# Altium project RelayTester.PrjPcb
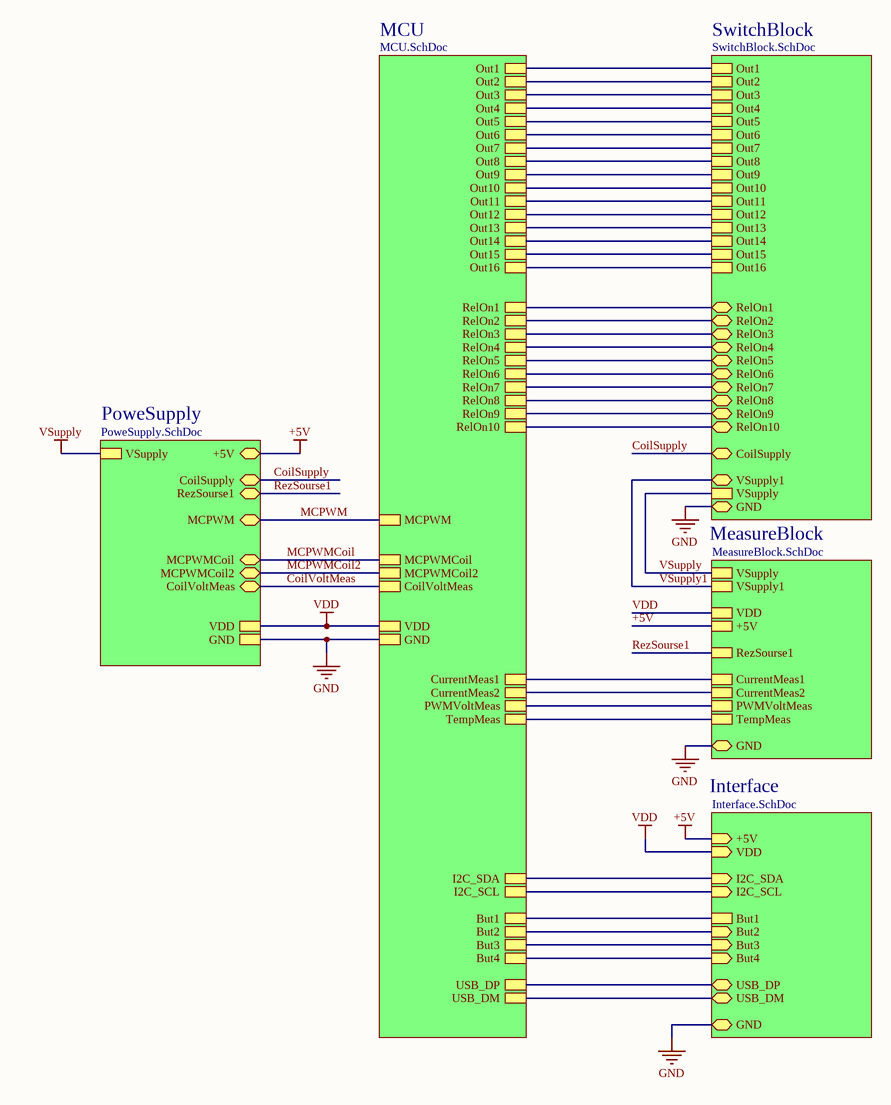
[diagram p0: RelayTester.SchDoc]
Adress2: Ivan Perehiniak
6 sheets, 234 parts. Net scope: hierarchical (ports join the sheet entries above them; power ports are global).
Board file: RelayTester.PcbDoc
Sheets:
  RelayTester.SchDoc
    Interface = Interface.SchDoc
    PoweSupply = PoweSupply.SchDoc
    MeasureBlock = MeasureBlock.SchDoc
    MCU = MCU.SchDoc
    SwitchBlock = SwitchBlock.SchDoc

## Sheet RelayTester.SchDoc: Relay Tester
size A4 portrait; Date: 2018.12.12; DrawnBy: Ivan Perehiniak; Address2: Ivan Perehiniak; Address3: iv.perehinik@gmail.com; Revision: 3; SheetNumber: 1; SheetTotal: 6; ProjectName: Relay Tester

### Sub-sheets
Interface = Interface.SchDoc: +5V, I2C_SDA, I2C_SCL, GND, But1, But2, But3, But4, VDD, USB_DM, USB_DP
MCU = MCU.SchDoc: But1, But2, But3, But4, I2C_SCL, I2C_SDA, Out9, Out8, RelOn5, RelOn6, RelOn3, RelOn4, RelOn1, RelOn2, CoilVoltMeas, PWMVoltMeas, CurrentMeas1, CurrentMeas2, TempMeas, MCPWMCoil, MCPWM, RelOn9, RelOn10, MCPWMCoil2, USB_DM, USB_DP, Out13, Out15, Out14, Out16, RelOn7, RelOn8, Out1, Out3, Out2, Out4, Out6, Out5, Out7, Out10, Out12, Out11, VDD, GND
MeasureBlock = MeasureBlock.SchDoc: VSupply1, VSupply, VDD, CurrentMeas1, RezSourse1, PWMVoltMeas, CurrentMeas2, TempMeas, +5V, GND
PoweSupply = PoweSupply.SchDoc: VSupply, VDD, GND, +5V, CoilSupply, CoilVoltMeas, MCPWMCoil, MCPWMCoil2, MCPWM, RezSourse1
SwitchBlock = SwitchBlock.SchDoc: Out1, Out2, Out3, Out4, Out5, Out6, Out7, Out8, Out9, Out10, Out11, Out12, Out13, Out14, Out15, Out16, VSupply, GND, VSupply1, RelOn10, CoilSupply, RelOn9, RelOn8, RelOn4, RelOn7, RelOn2, RelOn3, RelOn1, RelOn5, RelOn6

### Nets
+5V: sheet Interface/+5V, sheet PoweSupply/+5V, sheet MeasureBlock/+5V
CoilSupply: sheet PoweSupply/CoilSupply, sheet SwitchBlock/CoilSupply
GND: sheet Interface/GND, sheet PoweSupply/GND, sheet MeasureBlock/GND, sheet MCU/GND, sheet SwitchBlock/GND
VDD: sheet Interface/VDD, sheet PoweSupply/VDD, sheet MeasureBlock/VDD, sheet MCU/VDD
VSupply: sheet PoweSupply/VSupply, sheet MeasureBlock/VSupply, sheet SwitchBlock/VSupply
But1: sheet Interface/But1, sheet MCU/But1
But2: sheet Interface/But2, sheet MCU/But2
But3: sheet Interface/But3, sheet MCU/But3
But4: sheet Interface/But4, sheet MCU/But4
CoilVoltMeas: sheet PoweSupply/CoilVoltMeas, sheet MCU/CoilVoltMeas
CurrentMeas1: sheet MeasureBlock/CurrentMeas1, sheet MCU/CurrentMeas1
CurrentMeas2: sheet MeasureBlock/CurrentMeas2, sheet MCU/CurrentMeas2
DM: sheet Interface/USB_DM, sheet MCU/USB_DM
DP: sheet Interface/USB_DP, sheet MCU/USB_DP
I2C_SCL: sheet Interface/I2C_SCL, sheet MCU/I2C_SCL
I2C_SDA: sheet Interface/I2C_SDA, sheet MCU/I2C_SDA
MCPWM: sheet PoweSupply/MCPWM, sheet MCU/MCPWM
MCPWMCoil: sheet PoweSupply/MCPWMCoil, sheet MCU/MCPWMCoil
MCPWMCoil2: sheet PoweSupply/MCPWMCoil2, sheet MCU/MCPWMCoil2
Out1: sheet MCU/Out1, sheet SwitchBlock/Out1
Out2: sheet MCU/Out2, sheet SwitchBlock/Out2
Out3: sheet MCU/Out3, sheet SwitchBlock/Out3
Out4: sheet MCU/Out4, sheet SwitchBlock/Out4
Out5: sheet MCU/Out5, sheet SwitchBlock/Out5
Out6: sheet MCU/Out6, sheet SwitchBlock/Out6
Out7: sheet MCU/Out7, sheet SwitchBlock/Out7
Out8: sheet MCU/Out8, sheet SwitchBlock/Out8
Out9: sheet MCU/Out9, sheet SwitchBlock/Out9
Out10: sheet MCU/Out10, sheet SwitchBlock/Out10
Out11: sheet MCU/Out11, sheet SwitchBlock/Out11
Out12: sheet MCU/Out12, sheet SwitchBlock/Out12
Out13: sheet MCU/Out13, sheet SwitchBlock/Out13
Out14: sheet MCU/Out14, sheet SwitchBlock/Out14
Out15: sheet MCU/Out15, sheet SwitchBlock/Out15
Out16: sheet MCU/Out16, sheet SwitchBlock/Out16
PWMVoltMeas: sheet MeasureBlock/PWMVoltMeas, sheet MCU/PWMVoltMeas
RelOn1: sheet MCU/RelOn1, sheet SwitchBlock/RelOn1
RelOn2: sheet MCU/RelOn2, sheet SwitchBlock/RelOn2
RelOn3: sheet MCU/RelOn3, sheet SwitchBlock/RelOn3
RelOn4: sheet MCU/RelOn4, sheet SwitchBlock/RelOn4
RelOn5: sheet MCU/RelOn5, sheet SwitchBlock/RelOn5
RelOn6: sheet MCU/RelOn6, sheet SwitchBlock/RelOn6
RelOn7: sheet MCU/RelOn7, sheet SwitchBlock/RelOn7
RelOn8: sheet MCU/RelOn8, sheet SwitchBlock/RelOn8
RelOn9: sheet MCU/RelOn9, sheet SwitchBlock/RelOn9
RelOn10: sheet MCU/RelOn10, sheet SwitchBlock/RelOn10
RezSourse1: sheet PoweSupply/RezSourse1, sheet MeasureBlock/RezSourse1
TempMeas: sheet MeasureBlock/TempMeas, sheet MCU/TempMeas
VSupply1: sheet MeasureBlock/VSupply1, sheet SwitchBlock/VSupply1

### Notes on the sheet
- Title
- Size:
- Date:
- A4
- Number:
- Time:
- Revision:
- Sheet
- of
- File:

## Sheet Interface.SchDoc: Relay Tester
size A4 portrait; Date: 2018.12.12; Author: Ivan Perehiniak; Address2: Ivan Perehiniak; Address3: iv.perehinik@gmail.com; Revision: 3; SheetNumber: 3; SheetTotal: 6
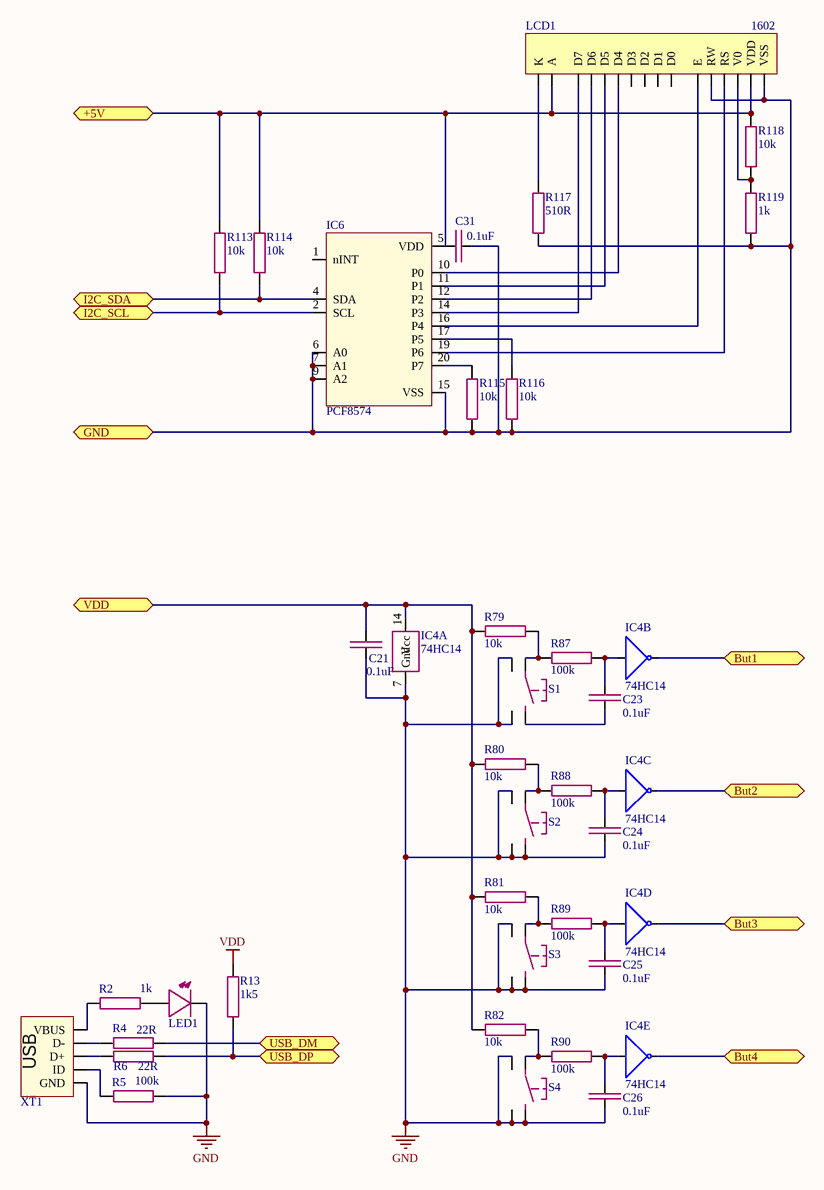
[diagram p1: Interface.SchDoc]

### Parts
C21  0.1uF  [C0603]
C23  0.1uF  [C0603]
C24  0.1uF  [C0603]
C25  0.1uF  [C0603]
C26  0.1uF  [C0603]
C31  0.1uF  [C0603]
IC4  74HC14  [SSOP14]  (parts A,B,C,D,E of 7)
IC6  PCF8574  [SSOP-20N]
LCD1  1602  [Display1602]
LED1  Green LED  [LED0805]  (value not drawn)
R2  1k  [R0603]
R4  22R  [R0603]
R5  100k  [R0603]
R6  22R  [R0603]
R13  1k5  [R0603]
R79  10k  [R0603]
R80  10k  [R0603]
R81  10k  [R0603]
R82  10k  [R0603]
R87  100k  [R0603]
R88  100k  [R0603]
R89  100k  [R0603]
R90  100k  [R0603]
R113  10k  [R0603]
R114  10k  [R0603]
R115  10k  [R0603]
R116  10k  [R0603]
R117  510R  [R0603]
R118  10k  [R0603]
R119  1k  [R0603]
S1  1301.9503  [SW_TACT_HOR]  (value not drawn)
S2  1301.9503  [SW_TACT_HOR]  (value not drawn)
S3  1301.9503  [SW_TACT_HOR]  (value not drawn)
S4  1301.9503  [SW_TACT_HOR]  (value not drawn)
XT1  UX60-MB-5ST  [MiniUSB]  (value not drawn)

### Ports
+5V, But1, But2, But3, But4, GND, I2C_SCL, I2C_SDA, USB_DM, USB_DP, VDD

### Nets
+5V: C31.2 IC6.5(VDD) LCD1.2(VDD) LCD1.15(A) R113.2 R114.2 R118.2 ; port +5V
GND: C21.1 C24.1 C25.1 C26.1 C31.1 IC4.7(Gnd) IC6.6(A0) IC6.7(A1) IC6.9(A2) IC6.15(VSS) LCD1.1(VSS) LCD1.5(RW) LED1.2(Cathode) R5.2 R115.1 R116.1 R117.2 R119.1 S1.1 S1.3 S2.1 S2.3 S2.4 S3.1 S3.3 S3.4 S4.1 S4.3 S4.4 XT1.5(GND) ; port GND
VDD: C21.2 IC4.14(Vcc) R13.2 R79.2 R80.2 R81.2 R82.2 ; port VDD
But1: IC4.2 ; port But1
But2: IC4.4 ; port But2
But3: IC4.6 ; port But3
But4: IC4.8 ; port But4
DM: R4.2 ; port USB_DM
DP: R6.2 R13.1 ; port USB_DP
I2C_SCL: IC6.2(SCL) R113.1 ; port I2C_SCL
I2C_SDA: IC6.4(SDA) R114.1 ; port I2C_SDA
NetC23_1: C23.1 S1.4
NetC23_2: C23.2 IC4.1 R87.2
NetC24_2: C24.2 IC4.3 R88.2
NetC25_2: C25.2 IC4.5 R89.2
NetC26_2: C26.2 IC4.9 R90.2
NetIC6_10: IC6.10(P0) LCD1.11(D4)
NetIC6_11: IC6.11(P1) LCD1.12(D5)
NetIC6_12: IC6.12(P2) LCD1.13(D6)
NetIC6_14: IC6.14(P3) LCD1.14(D7)
NetIC6_16: IC6.16(P4) LCD1.6(E)
NetIC6_17: IC6.17(P5) R116.2
NetIC6_19: IC6.19(P6) LCD1.4(RS)
NetIC6_20: IC6.20(P7) R115.2
NetLCD1_3: LCD1.3(V0) R118.1 R119.2
NetLCD1_16: LCD1.16(K) R117.1
NetLED1_1: LED1.1(Anode) R2.1
NetR2_2: R2.2 XT1.1(VBUS)
NetR4_1: R4.1 XT1.2(D-)
NetR5_1: R5.1 XT1.4(ID)
NetR6_1: R6.1 XT1.3(D+)
NetR79_1: R79.1 R87.1 S1.2
NetR80_1: R80.1 R88.1 S2.2
NetR81_1: R81.1 R89.1 S3.2
NetR82_1: R82.1 R90.1 S4.2

Not connected (* = marked no-connect by the designer): IC6 1(nINT); LCD1 7(D0) 8(D1) 9(D2) 10(D3)

### Notes on the sheet
- Title
- Size:
- Date:
- A4
- Number:
- Time:
- Revision:
- Sheet
- of
- File:
- (in symbol UX60-MB-5ST) USB

### Library data of the parts
C21 C23-C26 C31 = GMK316F475ZG-T: CAP CER 0.1UF 50V X7R 0603; Category: Capacitors; Manufacturer Part Number: GMK316F475ZG-T; Package / Case: 0603 (1608 Metric); ComponentLink1URL: https://search.kemet.com/component-edge/download/datasheet/C0603C104K5RACTU.pdf; ComponentLink1Description: https://search.kemet.com/component-edge/download/datasheet/C0603C104K5RACTU.pdf
IC4 = MC74HC14ADR2G: IC INVERTER HEX SCHMITT 14SOIC; Category: Integrated Circuits (ICs); Manufacturer Part Number: MC74HC14ADR2G; Package / Case: 14-SOIC (0.154", 3.90mm Width)
IC6 = PCF8574APWR: IC I/O EXPANDER I2C 8B 20TSSOP; Package / Case: 20-TSSOP (0.173", 4.40mm Width); Manufacturer Part Number: PCF8574APWR; Category: Integrated Circuits (ICs)
LCD1 = Display1602: DISP 1602 THT
LED1 = LG R971-KN-1: LED GREEN DIFFUSED 0805 SMD; Category: Optoelectronics; Manufacturer Part Number: LG R971-KN-1; Package / Case: 0805 (2012 Metric)
R2 R119 = ERJ-3GEYJ102V: RES SMD 1K OHM 5% 1/10W 0603; Category: Resistors; Package / Case: 0603 (1608 Metric); Manufacturer Part Number: ERJ-3GEYJ102V; ComponentLink1URL: https://industrial.panasonic.com/cdbs/www-data/pdf/RDA0000/AOA0000C304.pdf; ComponentLink1Description: https://industrial.panasonic.com/cdbs/www-data/pdf/RDA0000/AOA0000C304.pdf; ComponentLink2URL: http://industrial.panasonic.com/www-cgi/jvcr13pz.cgi?E+PZ+3+AOA0005+ERJS03J101V+7+WW; ComponentLink2Description: http://industrial.panasonic.com/www-cgi/jvcr13pz.cgi?E+PZ+3+AOA0005+ERJS03J101V+7+WW; ComponentLink3URL: https://industrial.panasonic.com/cdbs/www-data/pdf/RDO0000/AOA0000C331.pdf; ComponentLink3Description: https://industrial.panasonic.com/cdbs/www-data/pdf/RDO0000/AOA0000C331.pdf
R4 R6 = CRCW060322R0FKEA: RES SMD 22 OHM 1% 1/10W 0603; Category: Resistors; Package / Case: 0603 (1608 Metric); Manufacturer Part Number: CRCW060322R0FKEA
R5 R87-R90 = ERJ-S03J104V: RES SMD 100K OHM 5% 1/10W 0603; Category: Resistors; Package / Case: 0603 (1608 Metric); Manufacturer Part Number: ERJ-S03J104V; ComponentLink1URL: https://industrial.panasonic.com/cdbs/www-data/pdf/RDA0000/AOA0000C304.pdf; ComponentLink1Description: https://industrial.panasonic.com/cdbs/www-data/pdf/RDA0000/AOA0000C304.pdf; ComponentLink2URL: http://industrial.panasonic.com/www-cgi/jvcr13pz.cgi?E+PZ+3+AOA0005+ERJS03J101V+7+WW; ComponentLink2Description: http://industrial.panasonic.com/www-cgi/jvcr13pz.cgi?E+PZ+3+AOA0005+ERJS03J101V+7+WW; ComponentLink3URL: https://industrial.panasonic.com/cdbs/www-data/pdf/RDO0000/AOA0000C331.pdf; ComponentLink3Description: https://industrial.panasonic.com/cdbs/www-data/pdf/RDO0000/AOA0000C331.pdf
R13 = CRCW06031K50JNTABC: RES SMD 1K5 OHM 5% 1/10W 0603; Category: Resistors; Package / Case: 0603 (1608 Metric); Manufacturer Part Number: CRCW06031K50JNTABC
R79-R82 R113-R116 = ERJ-S03J103V: RES SMD 10K OHM 5% 1/10W 0603; Category: Resistors; Package / Case: 0603 (1608 Metric); Manufacturer Part Number: ERJ-S03J103V; ComponentLink1URL: https://industrial.panasonic.com/cdbs/www-data/pdf/RDA0000/AOA0000C304.pdf; ComponentLink1Description: https://industrial.panasonic.com/cdbs/www-data/pdf/RDA0000/AOA0000C304.pdf; ComponentLink2URL: http://industrial.panasonic.com/www-cgi/jvcr13pz.cgi?E+PZ+3+AOA0005+ERJS03J101V+7+WW; ComponentLink2Description: http://industrial.panasonic.com/www-cgi/jvcr13pz.cgi?E+PZ+3+AOA0005+ERJS03J101V+7+WW; ComponentLink3URL: https://industrial.panasonic.com/cdbs/www-data/pdf/RDO0000/AOA0000C331.pdf; ComponentLink3Description: https://industrial.panasonic.com/cdbs/www-data/pdf/RDO0000/AOA0000C331.pdf
R117 = ERJ-3GEYJ511V: RES SMD 510 OHM 5% 1/10W 0603; Category: Resistors; Package / Case: 0603 (1608 Metric); Manufacturer Part Number: ERJ-3GEYJ511V
R118 = CRCW060310K0FKTABC: RES SMD 10K OHM 1% 1/10W 0603; Category: Resistors; Package / Case: 0603 (1608 Metric); Manufacturer Part Number: CRCW060310K0FKTABC
S1-S4 = 1301.9503: SWITCH TACTILE HOR SPST-NO 0.05A 12V; Category: Switches; Manufacturer Part Number: 1301.9503
XT1 = UX60-MB-5ST: CONN RECEPT MINI USB2.0 5POS; Category: Connectors, Interconnects; Manufacturer Part Number: UX60-MB-5ST

## Sheet PoweSupply.SchDoc: Relay Tester
size A4 portrait; Date: 2018.12.12; Author: Ivan Perehiniak; Address2: Ivan Perehiniak; Address3: iv.perehinik@gmail.com; Revision: 3; SheetNumber: 4; SheetTotal: 6
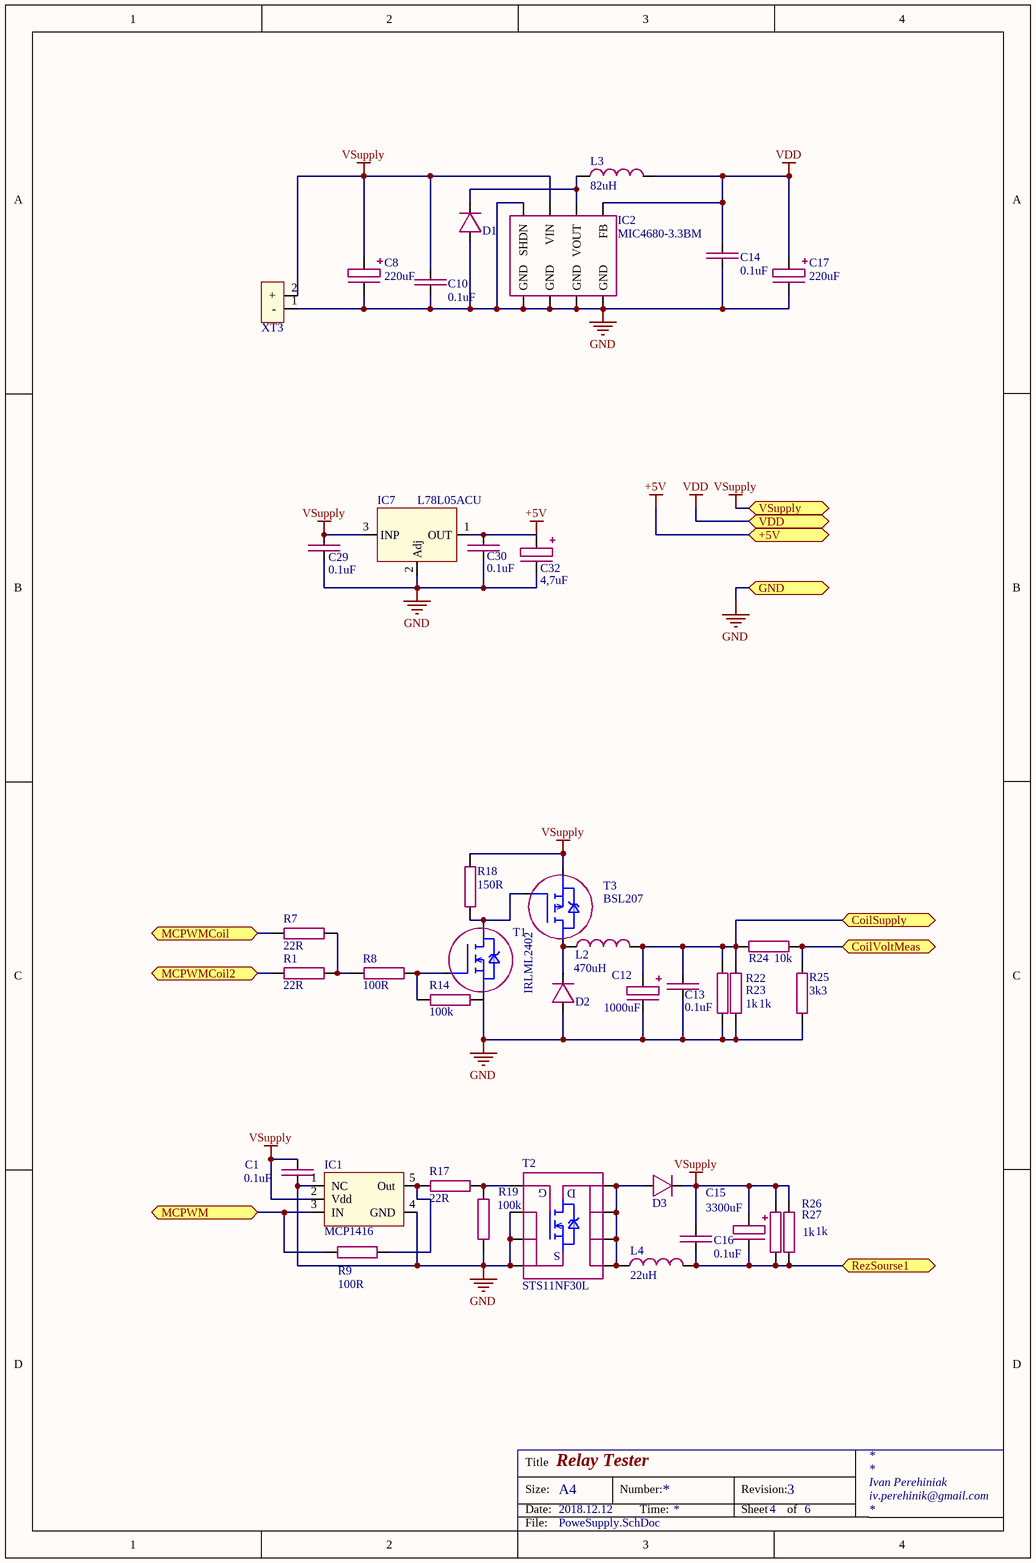
[diagram p2: PoweSupply.SchDoc]

### Parts
C1  0.1uF  [C0603]
C8  220uF  [CAP10x12]
C10  0.1uF  [C0603]
C12  1000uF  [CAP10x12]
C13  0.1uF  [C0603]
C14  0.1uF  [C0603]
C15  3300uF  [CAP12.5x20p]
C16  0.1uF  [C0603]
C17  220uF  [CAP6x11_Hor]
C29  0.1uF  [C0603]
C30  0.1uF  [C0603]
C32  4,7uF  [1206(Tantal A)]
D1  B260A-13-F  [SMA]  (value not drawn)
D2  SK54A-LTP  [SMA]  (value not drawn)
D3  SK54A-LTP  [SMA]  (value not drawn)
IC1  MCP1416  [SOT23-5]
IC2  MIC4680-3.3BM  [SOIC_N]
IC7  L78L05ACU  [SOT89-3]
L2  470uH  [B82477G4]
L3  82uH  [B82477G4]
L4  22uH  [B82477G4]
R1  22R  [R0603]
R7  22R  [R0603]
R8  100R  [R0603]
R9  100R  [R0603]
R14  100k  [R0603]
R17  22R  [R0603]
R18  150R  [Resistor_2W-2]
R19  100k  [R0603]
R22  1k  [R1206]
R23  1k  [R1206]
R24  10k  [R0603]
R25  3k3  [R0603]
R26  1k  [R1206]
R27  1k  [R1206]
T1  IRLML2402  [SOT-23]
T2  STS11NF30L  [SOIC_N]
T3  BSL207  [SOT23-6 - mosfet]
XT3  PowerJack5,5/2,1mm  [PowerJack5.5x2.1]  (value not drawn)

### Ports
+5V, CoilSupply, CoilVoltMeas, GND, MCPWM, MCPWMCoil, MCPWMCoil2, RezSourse1, VDD, VSupply

### Nets
+5V: C30.2 C32.1(+) IC7.1(OUT) ; port +5V
CoilSupply: C12.1(+) C13.2 L2.2 R22.2 R23.2 R24.1 ; port CoilSupply
GND: C1.2 C8.2(-) C10.1 C12.2(-) C13.1 C14.1 C17.2(-) C29.1 C30.1 C32.2(-) D1.1(Anode) D2.1(Anode) IC1.1(NC) IC1.4(GND) IC2.1(SHDN) IC2.5(GND) IC2.6(GND) IC2.7(GND) IC2.8(GND) IC7.2(Adj) R14.2 R19.1 R22.1 R23.1 R25.1 T1.2(SOURSE) T2.1(SOURSE) T2.2(SOURSE) T2.3(SOURSE) XT3.1(-) ; port GND
VDD: C14.2 C17.1(+) IC2.4(FB) L3.2 ; port VDD
VSupply: C1.1 C8.1(+) C10.2 C15.1(+) C16.1 C29.2 D3.2(Cathode) IC1.2(Vdd) IC2.2(VIN) IC7.3(INP) R18.2 R26.2 R27.2 T3.3(SOURSE) XT3.2(+) ; port VSupply
CoilVoltMeas: R24.2 R25.2 ; port CoilVoltMeas
MCPWM: IC1.3(IN) R9.1 ; port MCPWM
MCPWMCoil: R7.1 ; port MCPWMCoil
MCPWMCoil2: R1.2 ; port MCPWMCoil2
RezSourse1: C15.2(-) C16.2 L4.2 R26.1 R27.1 ; port RezSourse1
NetD1_2: D1.2(Cathode) IC2.3(VOUT) L3.1
NetD2_2: D2.2(Cathode) L2.1 T3.2(DRAIN)
NetD3_1: D3.1(Anode) L4.1 T2.5(DRAIN) T2.6(DRAIN) T2.7(DRAIN) T2.8(DRAIN)
NetIC1_5: IC1.5(Out) R9.2 R17.1
NetR1_1: R1.1 R7.2 R8.1
NetR8_2: R8.2 R14.1 T1.1(GATE)
NetR17_2: R17.2 R19.2 T2.4(GATE)
NetR18_1: R18.1 T1.3(DRAIN) T3.1(GATE)

### Notes on the sheet
- Title
- Size:
- Date:
- A4
- Number:
- Time:
- Revision:
- Sheet
- of
- File:
- (in symbol STS11NF30L) G; D; S

### Library data of the parts
C1 C10 C13 C14 C16 C29 C30 = GMK316F475ZG-T: CAP CER 0.1UF 50V X7R 0603; Category: Capacitors; Manufacturer Part Number: GMK316F475ZG-T; Package / Case: 0603 (1608 Metric); ComponentLink1URL: https://search.kemet.com/component-edge/download/datasheet/C0603C104K5RACTU.pdf; ComponentLink1Description: https://search.kemet.com/component-edge/download/datasheet/C0603C104K5RACTU.pdf
C8 = EEU-FC1V221L: CAP ALUM 220UF 20% 35V RADIAL; Category: Capacitors; Manufacturer Part Number: EEU-FC1V221L; Package / Case: Radial, Can
C12 = CE-1000/16PHT-Y: CAP ALUM 1000UF 20% 16V RADIAL; Category: Capacitors; Manufacturer Part Number: CE-1000/16PHT-Y; Package / Case: Radial, Can
C15 = UVR1C332MHD: CAP ALUM 3300UF 20% 16V RADIAL; Category: Capacitors; Manufacturer Part Number: UVR1C332MHD; Package / Case: Radial, Can
C17 = EEUFC1A221SH: CAP ALUM 220UF 20% 10V RADIAL; Category: Capacitors; Manufacturer Part Number: EEUFC1A221SH; Package / Case: Radial, Can
C32 = T491A475K010AT: CAP TANT 4.7UF 10V 10% 1206; Category: Capacitors; Manufacturer Part Number: T491A475K010AT; Package / Case: 1206 (3216 Metric)
D1 = B260A-13-F: DIODE SCHOTTKY 2A 40V SMA; Category: Discrete Semiconductor Products; Manufacturer Part Number: B260A-13-F; Package / Case: DO-214AC, SMA
D2 D3 = SK54A-LTP: DIODE SCHOTTKY 5A 40V SMA; Category: Discrete Semiconductor Products; Manufacturer Part Number: SK54A-LTP; Package / Case: DO-214AC, SMA
IC1 = MCP1416T-E/OT: IC MOSFET DVR 1.5A HS SOT23-5; Category: Integrated Circuits (ICs); Manufacturer Part Number: MCP1416T-E/OT; Package / Case: SC-74A, SOT-753,sot23/5
IC2 = MIC4680-3.3BM: BUCK CONV 3.3V 1A; Category: Discrete Semiconductor Products; Manufacturer Part Number: MIC4680-3.3BM; Package / Case: SOIC8
IC7 = L78L05ACU: IC REG LINEAR 5V 100MA SOT89-3; Manufacturer Part Number: L78L05ACU; Category: Integrated Circuits (ICs); Package / Case: TO-243AA
L2 = DE1207-470: FIXED IND 470UH 1A 741 MOHM SMD; Manufacturer Part Number: DE1207-390; Category: Inductors, Coils, Chokes; Package / Case: Nonstandard(10x10)
L3 = DE1205-82: FIXED IND 82UH 1.2A SMD; Category: Inductors, Coils, Chokes; Manufacturer Part Number: DE1205-82; Package / Case: Nonstandard(12x12)
L4 = DE1209-22: FIXED IND 22UH 5A 39 MOHM SMD; Category: Inductors, Coils, Chokes; Manufacturer Part Number: DE1209-22; Package / Case: Nonstandard(12.6x12.6)
R1 R7 R17 = CRCW060322R0FKEA: RES SMD 22 OHM 1% 1/10W 0603; Category: Resistors; Package / Case: 0603 (1608 Metric); Manufacturer Part Number: CRCW060322R0FKEA
R8 R9 = ERJ-S03J101V: RES SMD 100 OHM 5% 1/10W 0603; Category: Resistors; Package / Case: 0603 (1608 Metric); Manufacturer Part Number: ERJ-S03J101V; ComponentLink1URL: https://industrial.panasonic.com/cdbs/www-data/pdf/RDA0000/AOA0000C304.pdf; ComponentLink1Description: https://industrial.panasonic.com/cdbs/www-data/pdf/RDA0000/AOA0000C304.pdf; ComponentLink2URL: http://industrial.panasonic.com/www-cgi/jvcr13pz.cgi?E+PZ+3+AOA0005+ERJS03J101V+7+WW; ComponentLink2Description: http://industrial.panasonic.com/www-cgi/jvcr13pz.cgi?E+PZ+3+AOA0005+ERJS03J101V+7+WW
R14 R19 = ERJ-S03J104V: RES SMD 100K OHM 5% 1/10W 0603; Category: Resistors; Package / Case: 0603 (1608 Metric); Manufacturer Part Number: ERJ-S03J104V; ComponentLink1URL: https://industrial.panasonic.com/cdbs/www-data/pdf/RDA0000/AOA0000C304.pdf; ComponentLink1Description: https://industrial.panasonic.com/cdbs/www-data/pdf/RDA0000/AOA0000C304.pdf; ComponentLink2URL: http://industrial.panasonic.com/www-cgi/jvcr13pz.cgi?E+PZ+3+AOA0005+ERJS03J101V+7+WW; ComponentLink2Description: http://industrial.panasonic.com/www-cgi/jvcr13pz.cgi?E+PZ+3+AOA0005+ERJS03J101V+7+WW; ComponentLink3URL: https://industrial.panasonic.com/cdbs/www-data/pdf/RDO0000/AOA0000C331.pdf; ComponentLink3Description: https://industrial.panasonic.com/cdbs/www-data/pdf/RDO0000/AOA0000C331.pdf
R18 = 2WT-150OHM: RES THT 150 OHM 5% 2W; Category: Resistors; Manufacturer Part Number: 2WT-150OHM
R22 R23 R26 R27 = ERJ-8GEYJ102V: RES SMD 1K OHM 5% 1/4W 1206; Category: Resistors; Package / Case: 1206 (3216 Metric); Manufacturer Part Number: ERJ-8GEYJ102V; ComponentLink1URL: https://industrial.panasonic.com/cdbs/www-data/pdf/RDA0000/AOA0000C304.pdf; ComponentLink1Description: https://industrial.panasonic.com/cdbs/www-data/pdf/RDA0000/AOA0000C304.pdf; ComponentLink2URL: http://industrial.panasonic.com/www-cgi/jvcr13pz.cgi?E+PZ+3+AOA0005+ERJS03J101V+7+WW; ComponentLink2Description: http://industrial.panasonic.com/www-cgi/jvcr13pz.cgi?E+PZ+3+AOA0005+ERJS03J101V+7+WW
R24 = CRCW060310K0FKTABC: RES SMD 10K OHM 1% 1/10W 0603; Category: Resistors; Package / Case: 0603 (1608 Metric); Manufacturer Part Number: CRCW060310K0FKTABC
R25 = CRCW06033K30FKTABC: RES SMD 3.3K OHM 1% 1/10W 0603; Category: Resistors; Package / Case: 0603 (1608 Metric); Manufacturer Part Number: CRCW06033K30FKTABC
T1 = IRLML2402TRPBF: MOSFET N-CH 20V 1.2A SOT-23; Category: Discrete Semiconductor Products; Manufacturer Part Number: IRLML2402TRPBF; Package / Case: TO-236-3, SC-59, SOT-23-3
T2 = STS11NF30L: MOSFET N-CH 30V 11A 8-SOIC; Category: Discrete Semiconductor Products; Manufacturer Part Number: STS11NF30L; Package / Case: SOT-23-6
T3 = BSL207SPH6327XTSA1: MOSFET P-CH 20V 6A 6TSOP; Category: Discrete Semiconductor Products; Manufacturer Part Number: BSL207SPH6327XTSA1; Package / Case: SOT-23-6 Thin, TSOT-23-6
XT3 = PowerJack5,5/2,1mm: SIL VERTICAL PC TAIL PIN HEADER; Manufacturer Part Number: FC68148; Category: Connectors, Interconnects

## Sheet MeasureBlock.SchDoc: Relay Tester
size A4 portrait; Date: 2018.12.12; Author: Ivan Perehiniak; Address2: Ivan Perehiniak; Address3: iv.perehinik@gmail.com; Revision: 3; SheetNumber: 6; SheetTotal: 6
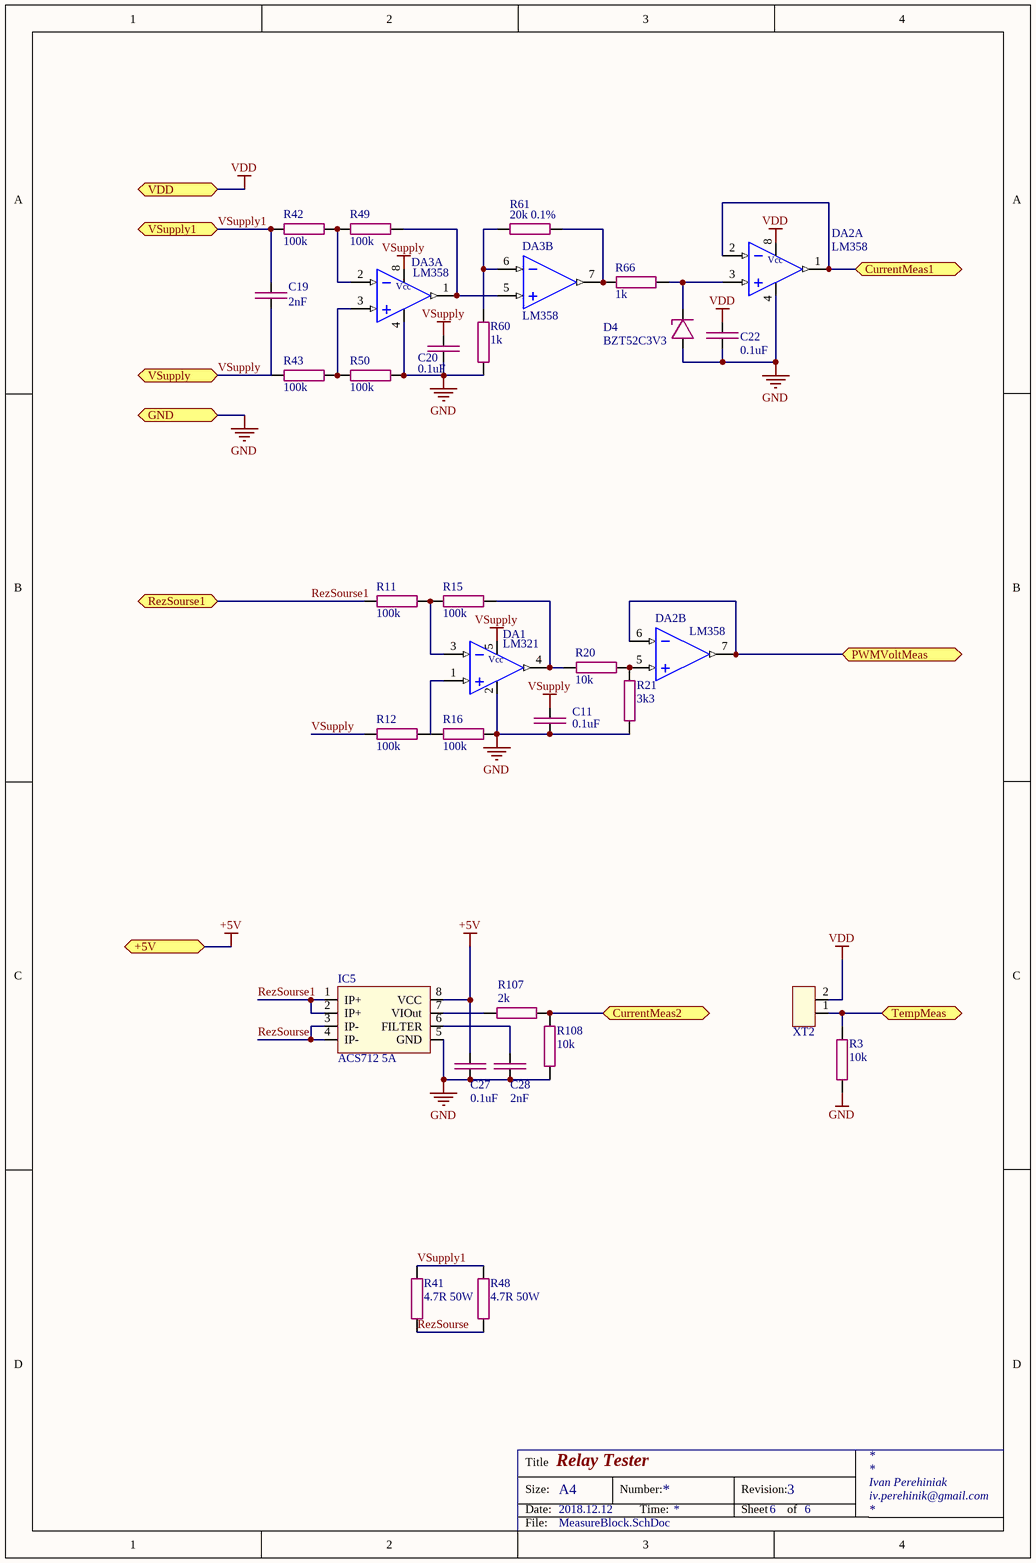
[diagram p3: MeasureBlock.SchDoc]

### Parts
C11  0.1uF  [C0603]
C19  2nF  [C0603]
C20  0.1uF  [C0603]
C22  0.1uF  [C0603]
C27  0.1uF  [C0603]
C28  2nF  [C0603]
D4  BZT52C3V3  [SOD123]
DA1  LM321  [SOT23-5]
DA2  LM358  [SOIC_N]  (parts A,B of 2)
DA3  LM358  [SOIC_N]  (parts A,B of 2)
IC5  ACS712 5A  [SOIC_N]
R3  10k  [R0603]
R11  100k  [R0603]
R12  100k  [R0603]
R15  100k  [R0603]
R16  100k  [R0603]
R20  10k  [R0603]
R21  3k3  [R0603]
R41  4.7R 50W  [TO-220-2-hor]
R42  100k  [R0603]
R43  100k  [R0603]
R48  4.7R 50W  [TO-220-2-hor]
R49  100k  [R0603]
R50  100k  [R0603]
R60  1k  [R0603]
R61  20k 0.1%  [R0603]
R66  1k  [R0603]
R107  2k  [R0603]
R108  10k  [R0603]
XT2  PLS-2  [PLS-2]  (value not drawn)

### Ports
+5V, CurrentMeas1, CurrentMeas2, GND, PWMVoltMeas, RezSourse1, TempMeas, VDD, VSupply, VSupply1

### Nets
+5V: C27.2 IC5.8(VCC) ; port +5V
GND: C11.1 C20.1 C22.1 C27.1 C28.1 D4.1(Anode) DA1.2(GND) DA2.4(GND) DA3.4(GND) IC5.5(GND) R3.1 R16.2 R21.1 R50.2 R60.1 R108.1 ; port GND
VDD: C22.2 DA2.8(Vcc) XT2.2 ; port VDD
VSupply: C11.2 C19.1 C20.2 DA1.5(Vcc) DA3.8(Vcc) R12.1 R43.1 ; port VSupply
CurrentMeas1: DA2.1(OUT1) DA2.2(IN1-) ; port CurrentMeas1
CurrentMeas2: R107.2 R108.2 ; port CurrentMeas2
PWMVoltMeas: DA2.6(IN2-) DA2.7(OUT2) ; port PWMVoltMeas
RezSourse: IC5.3(IP-) IC5.4(IP-) R41.2 R48.1
RezSourse1: IC5.1(IP+) IC5.2(IP+) R11.1 ; port RezSourse1
TempMeas: R3.2 XT2.1 ; port TempMeas
VSupply1: C19.2 R41.1 R42.1 R48.2 ; port VSupply1
NetC28_2: C28.2 IC5.6(FILTER)
NetD4_2: D4.2(Cathode) DA2.3(IN1+) R66.2
NetDA1_1: DA1.1(IN1+) R12.2 R16.1
NetDA1_3: DA1.3(IN1-) R11.2 R15.1
NetDA1_4: DA1.4(OUT1) R15.2 R20.2
NetDA2_5: DA2.5(IN2+) R20.1 R21.2
NetDA3_1: DA3.1(OUT1) DA3.5(IN2+) R49.2
NetDA3_2: DA3.2(IN1-) R42.2 R49.1
NetDA3_3: DA3.3(IN1+) R43.2 R50.1
NetDA3_6: DA3.6(IN2-) R60.2 R61.1
NetDA3_7: DA3.7(OUT2) R61.2 R66.1
NetIC5_7: IC5.7(VIOut) R107.1

### Notes on the sheet
- Title
- Size:
- Date:
- A4
- Number:
- Time:
- Revision:
- Sheet
- of
- File:

### Library data of the parts
C11 C20 C22 C27 = GMK316F475ZG-T: CAP CER 0.1UF 50V X7R 0603; Category: Capacitors; Manufacturer Part Number: GMK316F475ZG-T; Package / Case: 0603 (1608 Metric); ComponentLink1URL: https://search.kemet.com/component-edge/download/datasheet/C0603C104K5RACTU.pdf; ComponentLink1Description: https://search.kemet.com/component-edge/download/datasheet/C0603C104K5RACTU.pdf
C19 C28 = CL10B202KB8NNNC: CAP CER 2000PF 50V X7R 0603; Category: Capacitors; Manufacturer Part Number: CL10B202KB8NNNC; Package / Case: 0603 (1608 Metric); ComponentLink1URL: https://search.kemet.com/component-edge/download/datasheet/C0603C104K5RACTU.pdf; ComponentLink1Description: https://search.kemet.com/component-edge/download/datasheet/C0603C104K5RACTU.pdf; ComponentLink2URL: http://media.digikey.com/pdf/Data%20Sheets/Samsung%20PDFs/CL_Series_MLCC_ds.pdf; ComponentLink2Description: http://media.digikey.com/pdf/Data%20Sheets/Samsung%20PDFs/CL_Series_MLCC_ds.pdf
D4 = BZT52C3V3-7-F: Diode Zener Single 3.3V 6% 370mW 2-Pin SOD-123 T/R; Category: Discrete Semiconductor Products; Manufacturer Part Number: BZT52C3V3-7-F; Package / Case: SOD-123
DA1 = LM321: IC OPAMP GP 1.3MHZ RRO SOT23-5; Manufacturer Part Number: LMV321ILT; Category: Integrated Circuits (ICs); Package / Case: SC-74A, SOT-753
DA2 DA3 = LM358DT: Dual IC OPAMP GP 1.1MHZ 8SO; Category: Integrated Circuits (ICs); Manufacturer Part Number: LM358DT; Package / Case: 8-SOIC (0.154", 3.90mm Width); ComponentLink4URL: http://www.st.com/content/ccc/resource/technical/document/datasheet/61/46/87/01/98/ed/44/c5/CD00000464.pdf/files/CD00000464.pdf/jcr:content/translations/en.CD00000464.pdf; ComponentLink4Description: http://www.st.com/content/ccc/resource/technical/document/datasheet/61/46/87/01/98/ed/44/c5/CD00000464.pdf/files/CD00000464.pdf/jcr:content/translations/en.CD00000464.pdf
IC5 = ACS712ELCTR-05B: SENSOR CURRENT HALL 5A AC/DC; Manufacturer Part Number: ACS712ELCTR-05B-T; Category: Sensors, Transducers; Package / Case: 8-SOIC (0.154", 3.90mm Width)
R3 R20 R108 = CRCW060310K0FKTABC: RES SMD 10K OHM 1% 1/10W 0603; Category: Resistors; Package / Case: 0603 (1608 Metric); Manufacturer Part Number: CRCW060310K0FKTABC
R11 R12 R15 R16 R42 R43 R49 R50 = ERJ-S03J104V: RES SMD 100K OHM 5% 1/10W 0603; Category: Resistors; Package / Case: 0603 (1608 Metric); Manufacturer Part Number: ERJ-S03J104V; ComponentLink1URL: https://industrial.panasonic.com/cdbs/www-data/pdf/RDA0000/AOA0000C304.pdf; ComponentLink1Description: https://industrial.panasonic.com/cdbs/www-data/pdf/RDA0000/AOA0000C304.pdf; ComponentLink2URL: http://industrial.panasonic.com/www-cgi/jvcr13pz.cgi?E+PZ+3+AOA0005+ERJS03J101V+7+WW; ComponentLink2Description: http://industrial.panasonic.com/www-cgi/jvcr13pz.cgi?E+PZ+3+AOA0005+ERJS03J101V+7+WW; ComponentLink3URL: https://industrial.panasonic.com/cdbs/www-data/pdf/RDO0000/AOA0000C331.pdf; ComponentLink3Description: https://industrial.panasonic.com/cdbs/www-data/pdf/RDO0000/AOA0000C331.pdf
R21 = CRCW06033K30FKTABC: RES SMD 3.3K OHM 1% 1/10W 0603; Category: Resistors; Package / Case: 0603 (1608 Metric); Manufacturer Part Number: CRCW06033K30FKTABC
R41 R48 = RTO050F4R700JTE3: RES 4.7 OHM 50W 5% AXIAL; Category: Resistors; Package / Case: Axial; Manufacturer Part Number: RTO050F4R700JTE3
R60 R66 = ERJ-3GEYJ102V: RES SMD 1K OHM 5% 1/10W 0603; Category: Resistors; Package / Case: 0603 (1608 Metric); Manufacturer Part Number: ERJ-3GEYJ102V; ComponentLink1URL: https://industrial.panasonic.com/cdbs/www-data/pdf/RDA0000/AOA0000C304.pdf; ComponentLink1Description: https://industrial.panasonic.com/cdbs/www-data/pdf/RDA0000/AOA0000C304.pdf; ComponentLink2URL: http://industrial.panasonic.com/www-cgi/jvcr13pz.cgi?E+PZ+3+AOA0005+ERJS03J101V+7+WW; ComponentLink2Description: http://industrial.panasonic.com/www-cgi/jvcr13pz.cgi?E+PZ+3+AOA0005+ERJS03J101V+7+WW; ComponentLink3URL: https://industrial.panasonic.com/cdbs/www-data/pdf/RDO0000/AOA0000C331.pdf; ComponentLink3Description: https://industrial.panasonic.com/cdbs/www-data/pdf/RDO0000/AOA0000C331.pdf
R61 = ERA-3AEB203V: RES SMD 20K OHM 0.1% 1/10W 0603; Category: Resistors; Package / Case: 0603 (1608 Metric); Manufacturer Part Number: ERA-3AEB203V; ComponentLink1URL: https://industrial.panasonic.com/cdbs/www-data/pdf/RDA0000/AOA0000C304.pdf; ComponentLink1Description: https://industrial.panasonic.com/cdbs/www-data/pdf/RDA0000/AOA0000C304.pdf; ComponentLink2URL: https://industrial.panasonic.com/cdbs/www-data/pdf/RDM0000/AOA0000C307.pdf; ComponentLink2Description: https://industrial.panasonic.com/cdbs/www-data/pdf/RDM0000/AOA0000C307.pdf
R107 = CRCW06032K00FKTABC: RES SMD 2K OHM 1% 1/10W 0603; Category: Resistors; Package / Case: 0603 (1608 Metric); Manufacturer Part Number: CRCW06032K00FKTABC
XT2 = PLS-2: SIL VERTICAL PC TAIL PIN HEADER; Manufacturer Part Number: M20-9990246; Category: Connectors, Interconnects

## Sheet MCU.SchDoc: Relay Tester
size A4 portrait; Date: 2018.12.12; Author: Ivan Perehiniak; Address2: Ivan Perehiniak; Address3: iv.perehinik@gmail.com; Revision: 3; SheetNumber: 2; SheetTotal: 6
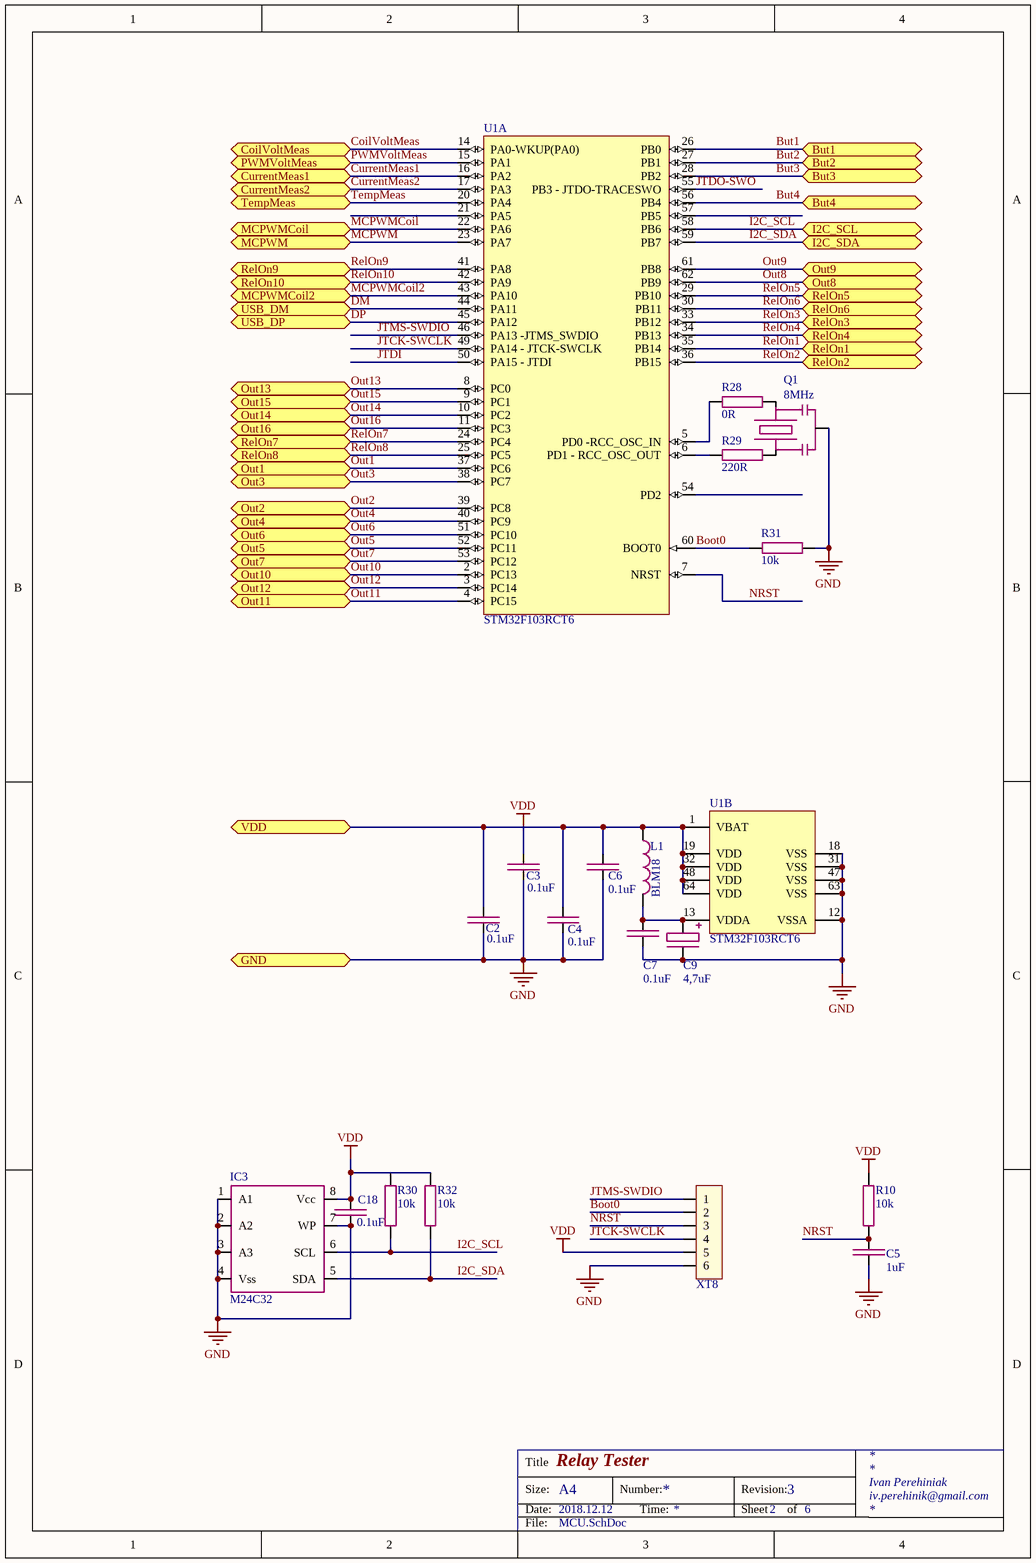
[diagram p4: MCU.SchDoc]

### Parts
C2  0.1uF  [C0603]
C3  0.1uF  [C0603]
C4  0.1uF  [C0603]
C5  1uF  [C0603]
C6  0.1uF  [C0603]
C7  0.1uF  [C0603]
C9  4,7uF  [1206(Tantal A)]
C18  0.1uF  [C0603]
IC3  M24C32  [SOIC_N]
L1  BLM18  [L0603]
Q1  8MHz  [CSTCE_V]
R10  10k  [R0603]
R28  0R  [R0603]
R29  220R  [R0603]
R30  10k  [R0603]
R31  10k  [R0603]
R32  10k  [R0603]
U1  STM32F103RCT6  [STM-LQFP64_V]  (parts A,B of 2)
XT8  PLS-6  [PLS-6]  (value not drawn)

### Ports
But1, But2, But3, But4, CoilVoltMeas, CurrentMeas1, CurrentMeas2, GND, I2C_SCL, I2C_SDA, MCPWM, MCPWMCoil, MCPWMCoil2, Out1, Out2, Out3, Out4, Out5, Out6, Out7, Out8, Out9, Out10, Out11, Out12, Out13, Out14, Out15, Out16, PWMVoltMeas, RelOn1, RelOn2, RelOn3, RelOn4, RelOn5, RelOn6, RelOn7, RelOn8, RelOn9, RelOn10, TempMeas, USB_DM, USB_DP, VDD

### Nets
GND: C2.1 C3.1 C4.1 C5.2 C6.1 C7.1 C9.2(-) C18.1 IC3.1(A1) IC3.2(A2) IC3.3(A3) IC3.4(Vss) IC3.7(WP) Q1.2 R31.2 U1.12(VSSA) U1.18(VSS) U1.31(VSS) U1.47(VSS) U1.63(VSS) XT8.6 ; port GND
VDD: C2.2 C3.2 C4.2 C6.2 C18.2 IC3.8(Vcc) L1.1 R10.2 R30.2 R32.2 U1.1(VBAT) U1.19(VDD) U1.32(VDD) U1.48(VDD) U1.64(VDD) XT8.5 ; port VDD
Boot0: R31.1 U1.60(BOOT0) XT8.2
But1: U1.26(PB0) ; port But1
But2: U1.27(PB1) ; port But2
But3: U1.28(PB2) ; port But3
But4: U1.56(PB4) ; port But4
CoilVoltMeas: U1.14(PA0-WKUP(PA0)) ; port CoilVoltMeas
CurrentMeas1: U1.16(PA2) ; port CurrentMeas1
CurrentMeas2: U1.17(PA3) ; port CurrentMeas2
DM: U1.44(PA11) ; port USB_DM
DP: U1.45(PA12) ; port USB_DP
I2C_SCL: IC3.6(SCL) R30.1 U1.58(PB6) ; port I2C_SCL
I2C_SDA: IC3.5(SDA) R32.1 U1.59(PB7) ; port I2C_SDA
JTCK-SWCLK: U1.49(PA14_-_JTCK-SWCLK) XT8.4
JTDI: U1.50(PA15_-_JTDI)
JTDO-SWO: U1.55(PB3_-_JTDO-TRACESWO)
JTMS-SWDIO: U1.46(PA13_-JTMS_SWDIO) XT8.1
MCPWM: U1.23(PA7) ; port MCPWM
MCPWMCoil: U1.22(PA6) ; port MCPWMCoil
MCPWMCoil2: U1.43(PA10) ; port MCPWMCoil2
NRST: C5.1 R10.1 U1.7(NRST) XT8.3
Out1: U1.37(PC6) ; port Out1
Out2: U1.39(PC8) ; port Out2
Out3: U1.38(PC7) ; port Out3
Out4: U1.40(PC9) ; port Out4
Out5: U1.52(PC11) ; port Out5
Out6: U1.51(PC10) ; port Out6
Out7: U1.53(PC12) ; port Out7
Out8: U1.62(PB9) ; port Out8
Out9: U1.61(PB8) ; port Out9
Out10: U1.2(PC13) ; port Out10
Out11: U1.4(PC15) ; port Out11
Out12: U1.3(PC14) ; port Out12
Out13: U1.8(PC0) ; port Out13
Out14: U1.10(PC2) ; port Out14
Out15: U1.9(PC1) ; port Out15
Out16: U1.11(PC3) ; port Out16
PWMVoltMeas: U1.15(PA1) ; port PWMVoltMeas
RelOn1: U1.35(PB14) ; port RelOn1
RelOn2: U1.36(PB15) ; port RelOn2
RelOn3: U1.33(PB12) ; port RelOn3
RelOn4: U1.34(PB13) ; port RelOn4
RelOn5: U1.29(PB10) ; port RelOn5
RelOn6: U1.30(PB11) ; port RelOn6
RelOn7: U1.24(PC4) ; port RelOn7
RelOn8: U1.25(PC5) ; port RelOn8
RelOn9: U1.41(PA8) ; port RelOn9
RelOn10: U1.42(PA9) ; port RelOn10
TempMeas: U1.20(PA4) ; port TempMeas
NetC7_2: C7.2 C9.1(+) L1.2 U1.13(VDDA)
NetQ1_1: Q1.1 R29.2
NetQ1_3: Q1.3 R28.2
NetR28_1: R28.1 U1.5(PD0_-RCC_OSC_IN)
NetR29_1: R29.1 U1.6(PD1_-_RCC_OSC_OUT)

Not connected (* = marked no-connect by the designer): U1 21(PA5) 54(PD2) 57(PB5)

### Notes on the sheet
- Title
- Size:
- Date:
- A4
- Number:
- Time:
- Revision:
- Sheet
- of
- File:

### Library data of the parts
C2-C4 C6 C7 C18 = GMK316F475ZG-T: CAP CER 0.1UF 50V X7R 0603; Category: Capacitors; Manufacturer Part Number: GMK316F475ZG-T; Package / Case: 0603 (1608 Metric); ComponentLink1URL: https://search.kemet.com/component-edge/download/datasheet/C0603C104K5RACTU.pdf; ComponentLink1Description: https://search.kemet.com/component-edge/download/datasheet/C0603C104K5RACTU.pdf
C5 = GRM188R71E105KA12D: CAP CER 1UF 25V X7R 0603; Category: Capacitors; Manufacturer Part Number: GRM188R71E105KA12D; Package / Case: 0603 (1608 Metric)
C9 = T491A475K010AT: CAP TANT 4.7UF 10V 10% 1206; Category: Capacitors; Manufacturer Part Number: T491A475K010AT; Package / Case: 1206 (3216 Metric)
IC3 = M24C32-WMN6TP: IC EEPROM 32KBIT 400KHZ 8SO; Category: Integrated Circuits (ICs); Package / Case: 8-SOIC (0.154", 3.90mm Width); Manufacturer Part Number: M24C32-WMN6TP
L1 = BLM18TG601TN1D: FERRITE BEAD 600 OHM 0603 1LN; Category: Filters; Manufacturer Part Number: BLM18TG601TN1D; Package / Case: 0603 (1608 Metric)
Q1 = CSTCE8M00G55Z-R0: CER RES 8.0000MHZ 33PF SMD; Manufacturer Part Number: CSTCE8M00G55Z-R0; Package / Case: 3-SMD, Non-Standard; Category: Crystals, Oscillators, Resonators; ComponentLink1URL: http://www.murata.com/~/media/webrenewal/support/library/catalog/products/timingdevice/ceralock/p16e.ashx; ComponentLink1Description: http://www.murata.com/~/media/webrenewal/support/library/catalog/products/timingdevice/ceralock/p16e.ashx
R10 R30-R32 = ERJ-S03J103V: RES SMD 10K OHM 5% 1/10W 0603; Category: Resistors; Package / Case: 0603 (1608 Metric); Manufacturer Part Number: ERJ-S03J103V; ComponentLink1URL: https://industrial.panasonic.com/cdbs/www-data/pdf/RDA0000/AOA0000C304.pdf; ComponentLink1Description: https://industrial.panasonic.com/cdbs/www-data/pdf/RDA0000/AOA0000C304.pdf; ComponentLink2URL: http://industrial.panasonic.com/www-cgi/jvcr13pz.cgi?E+PZ+3+AOA0005+ERJS03J101V+7+WW; ComponentLink2Description: http://industrial.panasonic.com/www-cgi/jvcr13pz.cgi?E+PZ+3+AOA0005+ERJS03J101V+7+WW; ComponentLink3URL: https://industrial.panasonic.com/cdbs/www-data/pdf/RDO0000/AOA0000C331.pdf; ComponentLink3Description: https://industrial.panasonic.com/cdbs/www-data/pdf/RDO0000/AOA0000C331.pdf
R28 = CRCW06030000Z0EA: RES SMD 0 OHM JUMPER 1/10W 0603; Category: Resistors; Package / Case: 0603 (1608 Metric); Manufacturer Part Number: CRCW06030000Z0EA
R29 = ERJ-3GEYJ221V: RES SMD 220 OHM 5% 1/10W 0603; Category: Resistors; Package / Case: 0603 (1608 Metric); Manufacturer Part Number: ERJ-3GEYJ221V; ComponentLink1URL: https://industrial.panasonic.com/cdbs/www-data/pdf/RDA0000/AOA0000C304.pdf; ComponentLink1Description: https://industrial.panasonic.com/cdbs/www-data/pdf/RDA0000/AOA0000C304.pdf; ComponentLink2URL: http://industrial.panasonic.com/www-cgi/jvcr13pz.cgi?E+PZ+3+AOA0005+ERJS03J101V+7+WW; ComponentLink2Description: http://industrial.panasonic.com/www-cgi/jvcr13pz.cgi?E+PZ+3+AOA0005+ERJS03J101V+7+WW; ComponentLink3URL: https://industrial.panasonic.com/cdbs/www-data/pdf/RDO0000/AOA0000C331.pdf; ComponentLink3Description: https://industrial.panasonic.com/cdbs/www-data/pdf/RDO0000/AOA0000C331.pdf
U1 = STM32F103RCT6: IC MCU 32BIT 256KB FLASH 64LQFP; Category: Integrated Circuits (ICs); Manufacturer Part Number: STM32F103RCT6; Package / Case: 64-LQFP
XT8 = PLS-6: CONN HEADER 6POS .100 STR TIN; Manufacturer Part Number: 68000-407HLF; Category: Connectors, Interconnects

## Sheet SwitchBlock.SchDoc: Relay Tester
size A4 portrait; Date: 2018.12.12; Author: Ivan Perehiniak; Address2: Ivan Perehiniak; Address3: iv.perehinik@gmail.com; Revision: 3; SheetNumber: 5; SheetTotal: 6
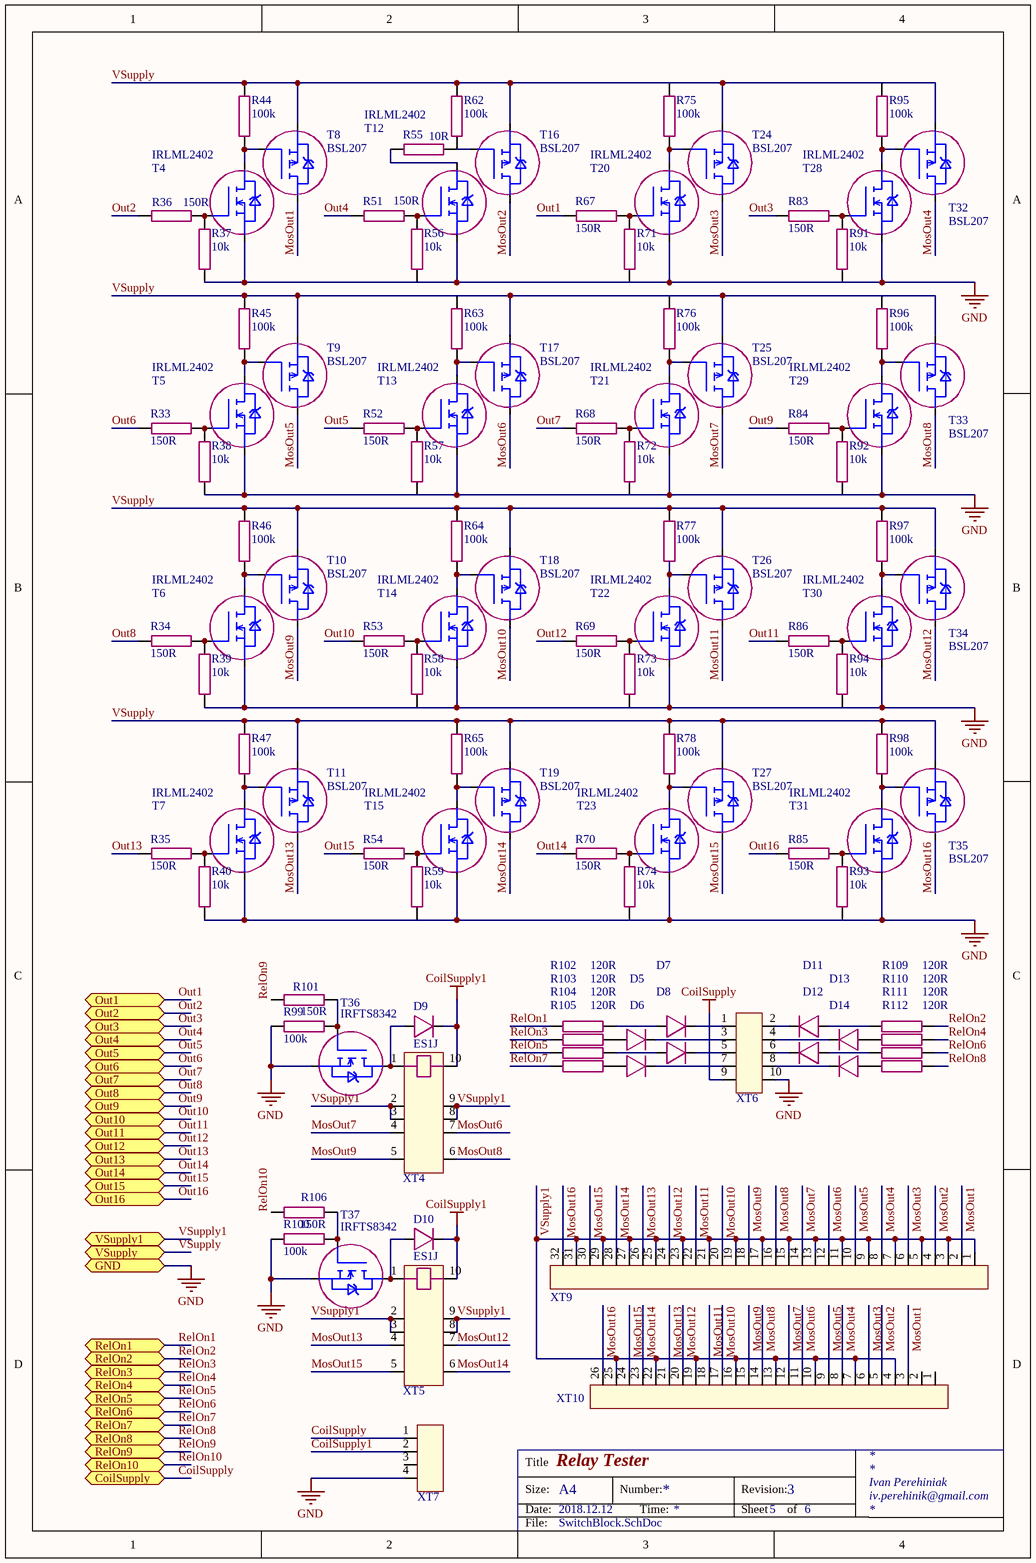
[diagram p5: SwitchBlock.SchDoc]

### Parts
D5  1N4148W  [SOD323]  (value not drawn)
D6  1N4148W  [SOD323]  (value not drawn)
D7  1N4148W  [SOD323]  (value not drawn)
D8  1N4148W  [SOD323]  (value not drawn)
D9  ES1J  [SMA]
D10  ES1J  [SMA]
D11  1N4148W  [SOD323]  (value not drawn)
D12  1N4148W  [SOD323]  (value not drawn)
D13  1N4148W  [SOD323]  (value not drawn)
D14  1N4148W  [SOD323]  (value not drawn)
R33  150R  [R0603]
R34  150R  [R0603]
R35  150R  [R0603]
R36  150R  [R0603]
R37  10k  [R0603]
R38  10k  [R0603]
R39  10k  [R0603]
R40  10k  [R0603]
R44  100k  [R0603]
R45  100k  [R0603]
R46  100k  [R0603]
R47  100k  [R0603]
R51  150R  [R0603]
R52  150R  [R0603]
R53  150R  [R0603]
R54  150R  [R0603]
R55  10R  [R1206]
R56  10k  [R0603]
R57  10k  [R0603]
R58  10k  [R0603]
R59  10k  [R0603]
R62  100k  [R0603]
R63  100k  [R0603]
R64  100k  [R0603]
R65  100k  [R0603]
R67  150R  [R0603]
R68  150R  [R0603]
R69  150R  [R0603]
R70  150R  [R0603]
R71  10k  [R0603]
R72  10k  [R0603]
R73  10k  [R0603]
R74  10k  [R0603]
R75  100k  [R0603]
R76  100k  [R0603]
R77  100k  [R0603]
R78  100k  [R0603]
R83  150R  [R0603]
R84  150R  [R0603]
R85  150R  [R0603]
R86  150R  [R0603]
R91  10k  [R0603]
R92  10k  [R0603]
R93  10k  [R0603]
R94  10k  [R0603]
R95  100k  [R0603]
R96  100k  [R0603]
R97  100k  [R0603]
R98  100k  [R0603]
R99  100k  [R0603]
R100  100k  [R0603]
R101  150R  [R0603]
R102  120R  [R0603]
R103  120R  [R0603]
R104  120R  [R0603]
R105  120R  [R0603]
R106  150R  [R0603]
R109  120R  [R0603]
R110  120R  [R0603]
R111  120R  [R0603]
R112  120R  [R0603]
T4  IRLML2402  [SOT-23]
T5  IRLML2402  [SOT-23]
T6  IRLML2402  [SOT-23]
T7  IRLML2402  [SOT-23]
T8  BSL207  [SOT23-6 - mosfet]
T9  BSL207  [SOT23-6 - mosfet]
T10  BSL207  [SOT23-6 - mosfet]
T11  BSL207  [SOT23-6 - mosfet]
T12  IRLML2402  [SOT-23]
T13  IRLML2402  [SOT-23]
T14  IRLML2402  [SOT-23]
T15  IRLML2402  [SOT-23]
T16  BSL207  [SOT23-6 - mosfet]
T17  BSL207  [SOT23-6 - mosfet]
T18  BSL207  [SOT23-6 - mosfet]
T19  BSL207  [SOT23-6 - mosfet]
T20  IRLML2402  [SOT-23]
T21  IRLML2402  [SOT-23]
T22  IRLML2402  [SOT-23]
T23  IRLML2402  [SOT-23]
T24  BSL207  [SOT23-6 - mosfet]
T25  BSL207  [SOT23-6 - mosfet]
T26  BSL207  [SOT23-6 - mosfet]
T27  BSL207  [SOT23-6 - mosfet]
T28  IRLML2402  [SOT-23]
T29  IRLML2402  [SOT-23]
T30  IRLML2402  [SOT-23]
T31  IRLML2402  [SOT-23]
T32  BSL207  [SOT23-6 - mosfet]
T33  BSL207  [SOT23-6 - mosfet]
T34  BSL207  [SOT23-6 - mosfet]
T35  BSL207  [SOT23-6 - mosfet]
T36  IRFTS8342  [SOT23-6 - mosfet]
T37  IRFTS8342  [SOT23-6 - mosfet]
XT4  RelSocket  [RelaySocket16Pin]  (value not drawn)
XT5  RelSocket  [RelaySocket16Pin]  (value not drawn)
XT6  IDC10  [PLD10-2]  (value not drawn)
XT7  PLS-4  [PLS-4]  (value not drawn)
XT9  PLS-32  [PLS-32female]  (value not drawn)
XT10  PLS-26  [PLS-26female]  (value not drawn)

### Ports
CoilSupply, GND, Out1, Out2, Out3, Out4, Out5, Out6, Out7, Out8, Out9, Out10, Out11, Out12, Out13, Out14, Out15, Out16, RelOn1, RelOn2, RelOn3, RelOn4, RelOn5, RelOn6, RelOn7, RelOn8, RelOn9, RelOn10, VSupply, VSupply1

### Nets
CoilSupply: XT6.9 XT7.1 ; port CoilSupply
CoilSupply1: D9.2(Cathode) D10.2(Cathode) XT4.10 XT5.10 XT7.2
GND: R37.1 R38.1 R39.1 R40.1 R56.1 R57.1 R58.1 R59.1 R71.1 R72.1 R73.1 R74.1 R91.1 R92.1 R93.1 R94.1 R99.2 R100.2 T4.2(SOURSE) T5.2(SOURSE) T6.2(SOURSE) T7.2(SOURSE) T12.2(SOURSE) T13.2(SOURSE) T14.2(SOURSE) T15.2(SOURSE) T20.2(SOURSE) T21.2(SOURSE) T22.2(SOURSE) T23.2(SOURSE) T28.2(SOURSE) T29.2(SOURSE) T30.2(SOURSE) T31.2(SOURSE) T36.3(SOURSE) T37.3(SOURSE) XT6.10 XT7.4 ; port GND
VSupply: R44.2 R45.2 R46.2 R47.2 R62.2 R63.2 R64.2 R65.2 R75.2 R76.2 R77.2 R78.2 R95.2 R96.2 R97.2 R98.2 T8.3(SOURSE) T9.3(SOURSE) T10.3(SOURSE) T11.3(SOURSE) T16.3(SOURSE) T17.3(SOURSE) T18.3(SOURSE) T19.3(SOURSE) T24.3(SOURSE) T25.3(SOURSE) T26.3(SOURSE) T27.3(SOURSE) T32.3(SOURSE) T33.3(SOURSE) T34.3(SOURSE) T35.3(SOURSE) ; port VSupply
MosOut1: T8.2(DRAIN) XT9.2 XT10.3
MosOut2: T16.2(DRAIN) XT9.4 XT10.5
MosOut3: T24.2(DRAIN) XT9.6 XT10.6
MosOut4: T32.2(DRAIN) XT9.8 XT10.8
MosOut5: T9.2(DRAIN) XT9.10 XT10.9
MosOut6: T17.2(DRAIN) XT4.7 XT9.12 XT10.11
MosOut7: T25.2(DRAIN) XT4.4 XT9.14 XT10.12
MosOut8: T33.2(DRAIN) XT4.6 XT9.16 XT10.14
MosOut9: T10.2(DRAIN) XT4.5 XT9.18 XT10.15
MosOut10: T18.2(DRAIN) XT9.20 XT10.17
MosOut11: T26.2(DRAIN) XT9.22 XT10.18
MosOut12: T34.2(DRAIN) XT5.7 XT9.24 XT10.20
MosOut13: T11.2(DRAIN) XT5.4 XT9.26 XT10.21
MosOut14: T19.2(DRAIN) XT5.6 XT9.28 XT10.23
MosOut15: T27.2(DRAIN) XT5.5 XT9.30 XT10.24
MosOut16: T35.2(DRAIN) XT9.32 XT10.26
Out1: R67.1 ; port Out1
Out2: R36.1 ; port Out2
Out3: R83.1 ; port Out3
Out4: R51.1 ; port Out4
Out5: R52.1 ; port Out5
Out6: R33.1 ; port Out6
Out7: R68.1 ; port Out7
Out8: R34.1 ; port Out8
Out9: R84.1 ; port Out9
Out10: R53.1 ; port Out10
Out11: R86.1 ; port Out11
Out12: R69.1 ; port Out12
Out13: R35.1 ; port Out13
Out14: R70.1 ; port Out14
Out15: R54.1 ; port Out15
Out16: R85.1 ; port Out16
RelOn1: R102.1 ; port RelOn1
RelOn2: R109.2 ; port RelOn2
RelOn3: R103.1 ; port RelOn3
RelOn4: R110.2 ; port RelOn4
RelOn5: R104.1 ; port RelOn5
RelOn6: R111.2 ; port RelOn6
RelOn7: R105.1 ; port RelOn7
RelOn8: R112.2 ; port RelOn8
RelOn9: R101.1 ; port RelOn9
RelOn10: R106.1 ; port RelOn10
VSupply1: XT4.2 XT4.3 XT4.8 XT4.9 XT5.2 XT5.3 XT5.8 XT5.9 XT9.1 XT9.3 XT9.5 XT9.7 XT9.9 XT9.11 XT9.13 XT9.15 XT9.17 XT9.19 XT9.21 XT9.23 XT9.25 XT9.27 XT9.29 XT9.31 XT10.4 XT10.7 XT10.10 XT10.13 XT10.16 XT10.19 XT10.22 XT10.25 ; port VSupply1
NetD5_1: D5.1(Anode) R103.2
NetD5_2: D5.2(Cathode) XT6.3
NetD6_1: D6.1(Anode) R105.2
NetD6_2: D6.2(Cathode) XT6.7
NetD7_1: D7.1(Anode) R102.2
NetD7_2: D7.2(Cathode) XT6.1
NetD8_1: D8.1(Anode) R104.2
NetD8_2: D8.2(Cathode) XT6.5
NetD9_1: D9.1(Anode) T36.2(DRAIN) XT4.1
NetD10_1: D10.1(Anode) T37.2(DRAIN) XT5.1
NetD11_1: D11.1(Anode) R109.1
NetD11_2: D11.2(Cathode) XT6.2
NetD12_1: D12.1(Anode) R111.1
NetD12_2: D12.2(Cathode) XT6.6
NetD13_1: D13.1(Anode) R110.1
NetD13_2: D13.2(Cathode) XT6.4
NetD14_1: D14.1(Anode) R112.1
NetD14_2: D14.2(Cathode) XT6.8
NetR33_2: R33.2 R38.2 T5.1(GATE)
NetR34_2: R34.2 R39.2 T6.1(GATE)
NetR35_2: R35.2 R40.2 T7.1(GATE)
NetR36_2: R36.2 R37.2 T4.1(GATE)
NetR44_1: R44.1 T4.3(DRAIN) T8.1(GATE)
NetR45_1: R45.1 T5.3(DRAIN) T9.1(GATE)
NetR46_1: R46.1 T6.3(DRAIN) T10.1(GATE)
NetR47_1: R47.1 T7.3(DRAIN) T11.1(GATE)
NetR51_2: R51.2 R56.2 T12.1(GATE)
NetR52_2: R52.2 R57.2 T13.1(GATE)
NetR53_2: R53.2 R58.2 T14.1(GATE)
NetR54_2: R54.2 R59.2 T15.1(GATE)
NetR55_1: R55.1 T12.3(DRAIN)
NetR55_2: R55.2 R62.1 T16.1(GATE)
NetR63_1: R63.1 T13.3(DRAIN) T17.1(GATE)
NetR64_1: R64.1 T14.3(DRAIN) T18.1(GATE)
NetR65_1: R65.1 T15.3(DRAIN) T19.1(GATE)
NetR67_2: R67.2 R71.2 T20.1(GATE)
NetR68_2: R68.2 R72.2 T21.1(GATE)
NetR69_2: R69.2 R73.2 T22.1(GATE)
NetR70_2: R70.2 R74.2 T23.1(GATE)
NetR75_1: R75.1 T20.3(DRAIN) T24.1(GATE)
NetR76_1: R76.1 T21.3(DRAIN) T25.1(GATE)
NetR77_1: R77.1 T22.3(DRAIN) T26.1(GATE)
NetR78_1: R78.1 T23.3(DRAIN) T27.1(GATE)
NetR83_2: R83.2 R91.2 T28.1(GATE)
NetR84_2: R84.2 R92.2 T29.1(GATE)
NetR85_2: R85.2 R93.2 T31.1(GATE)
NetR86_2: R86.2 R94.2 T30.1(GATE)
NetR95_1: R95.1 T28.3(DRAIN) T32.1(GATE)
NetR96_1: R96.1 T29.3(DRAIN) T33.1(GATE)
NetR97_1: R97.1 T30.3(DRAIN) T34.1(GATE)
NetR98_1: R98.1 T31.3(DRAIN) T35.1(GATE)
NetR99_1: R99.1 R101.2 T36.1(GATE)
NetR100_1: R100.1 R106.2 T37.1(GATE)

Not connected (* = marked no-connect by the designer): XT7 3; XT10 1 2

### Notes on the sheet
- Title
- Size:
- Date:
- A4
- Number:
- Time:
- Revision:
- Sheet
- of
- File:

### Library data of the parts
D5-D8 D11-D14 = 1N4148WX-TP: DIODE GEN PURP 75V 150MA SOD323; Category: Discrete Semiconductor Products; Manufacturer Part Number: 1N4148WX-TP; Package / Case: SC-76, SOD-323; Base Part Number: 1N4148WX
D9 D10 = ES1J-LTP: DIODE GEN PURP 600V 1A DO214AC; Category: Discrete Semiconductor Products; Manufacturer Part Number: ES1J-LTP; Package / Case: DO-214AC, SMA
R33-R36 R51-R54 R67-R70 R83-R86 R101 R106 = RC0603JR-07150RL: RES SMD 150 OHM 5% 1/10W 0603; Category: Resistors; Manufacturer Part Number: RC0603JR-07150RL; Package / Case: 0603 (1608 Metric)
R37-R40 R56-R59 R71-R74 R91-R94 = ERJ-S03J103V: RES SMD 10K OHM 5% 1/10W 0603; Category: Resistors; Package / Case: 0603 (1608 Metric); Manufacturer Part Number: ERJ-S03J103V; ComponentLink1URL: https://industrial.panasonic.com/cdbs/www-data/pdf/RDA0000/AOA0000C304.pdf; ComponentLink1Description: https://industrial.panasonic.com/cdbs/www-data/pdf/RDA0000/AOA0000C304.pdf; ComponentLink2URL: http://industrial.panasonic.com/www-cgi/jvcr13pz.cgi?E+PZ+3+AOA0005+ERJS03J101V+7+WW; ComponentLink2Description: http://industrial.panasonic.com/www-cgi/jvcr13pz.cgi?E+PZ+3+AOA0005+ERJS03J101V+7+WW; ComponentLink3URL: https://industrial.panasonic.com/cdbs/www-data/pdf/RDO0000/AOA0000C331.pdf; ComponentLink3Description: https://industrial.panasonic.com/cdbs/www-data/pdf/RDO0000/AOA0000C331.pdf
R44-R47 R62-R65 R75-R78 R95-R100 = ERJ-S03J104V: RES SMD 100K OHM 5% 1/10W 0603; Category: Resistors; Package / Case: 0603 (1608 Metric); Manufacturer Part Number: ERJ-S03J104V; ComponentLink1URL: https://industrial.panasonic.com/cdbs/www-data/pdf/RDA0000/AOA0000C304.pdf; ComponentLink1Description: https://industrial.panasonic.com/cdbs/www-data/pdf/RDA0000/AOA0000C304.pdf; ComponentLink2URL: http://industrial.panasonic.com/www-cgi/jvcr13pz.cgi?E+PZ+3+AOA0005+ERJS03J101V+7+WW; ComponentLink2Description: http://industrial.panasonic.com/www-cgi/jvcr13pz.cgi?E+PZ+3+AOA0005+ERJS03J101V+7+WW; ComponentLink3URL: https://industrial.panasonic.com/cdbs/www-data/pdf/RDO0000/AOA0000C331.pdf; ComponentLink3Description: https://industrial.panasonic.com/cdbs/www-data/pdf/RDO0000/AOA0000C331.pdf
R55 = ERJ-8GEYJ100V: RES SMD 10 OHM 5% 1/4W 1206; Category: Resistors; Package / Case: 1206 (3216 Metric); Manufacturer Part Number: ERJ-8GEYJ100V; ComponentLink1URL: https://industrial.panasonic.com/cdbs/www-data/pdf/RDA0000/AOA0000C304.pdf; ComponentLink1Description: https://industrial.panasonic.com/cdbs/www-data/pdf/RDA0000/AOA0000C304.pdf; ComponentLink2URL: http://industrial.panasonic.com/www-cgi/jvcr13pz.cgi?E+PZ+3+AOA0005+ERJS03J101V+7+WW; ComponentLink2Description: http://industrial.panasonic.com/www-cgi/jvcr13pz.cgi?E+PZ+3+AOA0005+ERJS03J101V+7+WW
R102-R105 R109-R112 = ERJ-3GEYJ121V: RES SMD 120 OHM 5% 1/10W 0603; Category: Resistors; Package / Case: 0603 (1608 Metric); Manufacturer Part Number: ERJ-3GEYJ121V; ComponentLink3URL: https://industrial.panasonic.com/cdbs/www-data/pdf/RDO0000/AOA0000C331.pdf; ComponentLink3Description: https://industrial.panasonic.com/cdbs/www-data/pdf/RDO0000/AOA0000C331.pdf
T4-T7 T12-T15 T20-T23 T28-T31 = IRLML2402TRPBF: MOSFET N-CH 20V 1.2A SOT-23; Category: Discrete Semiconductor Products; Manufacturer Part Number: IRLML2402TRPBF; Package / Case: TO-236-3, SC-59, SOT-23-3
T8-T11 T16-T19 T24-T27 T32-T35 = BSL207SPH6327XTSA1: MOSFET P-CH 20V 6A 6TSOP; Category: Discrete Semiconductor Products; Manufacturer Part Number: BSL207SPH6327XTSA1; Package / Case: SOT-23-6 Thin, TSOT-23-6
T36 T37 = IRFTS8342: MOSFET N-CH 30V 8.2A 6TSOP; Manufacturer Part Number: IRFTS8342TRPBF; Category: Discrete Semiconductor Products; Package / Case: SOT-23-6
XT4 XT5 = RelSocket: REL SOCKET UNI 7.62x2.54 PITCH
XT6 = IDC10: DIL VERTICAL PC TAIL PIN HEADER; Manufacturer Part Number: 67997-410HLF; Category: Connectors, Interconnects
XT7 = PLS-4: CONN HEADER 4POS .100 STR TIN; Manufacturer Part Number: 68000-404HLF; Category: Connectors, Interconnects
XT9 = PLS-32: SIL VERTICAL PC TAIL PIN HEADER; Manufacturer Part Number: M20-9990346; Category: Connectors, Interconnects
XT10 = PLS-26: SIL VERTICAL PC TAIL PIN HEADER; Manufacturer Part Number: M20-9990346; Category: Connectors, Interconnects

## Nets that join several sheets
+5V: Interface (7 pins), PoweSupply (C30.2 C32.1 IC7.1), MeasureBlock (C27.2 IC5.8)
CoilSupply: PoweSupply (6 pins), SwitchBlock (XT6.9 XT7.1)
GND: Interface (30 pins), PoweSupply (30 pins), MeasureBlock (16 pins), MCU (21 pins), SwitchBlock (38 pins)
VDD: Interface (7 pins), PoweSupply (C14.2 C17.1 IC2.4 L3.2), MeasureBlock (C22.2 DA2.8 XT2.2), MCU (16 pins)
VSupply: PoweSupply (15 pins), MeasureBlock (7 pins), SwitchBlock (32 pins)
But1: Interface (IC4.2), MCU (U1.26)
But2: Interface (IC4.4), MCU (U1.27)
But3: Interface (IC4.6), MCU (U1.28)
But4: Interface (IC4.8), MCU (U1.56)
CoilVoltMeas: PoweSupply (R24.2 R25.2), MCU (U1.14)
CurrentMeas1: MeasureBlock (DA2.1 DA2.2), MCU (U1.16)
CurrentMeas2: MeasureBlock (R107.2 R108.2), MCU (U1.17)
DM: Interface (R4.2), MCU (U1.44)
DP: Interface (R6.2 R13.1), MCU (U1.45)
I2C_SCL: Interface (IC6.2 R113.1), MCU (IC3.6 R30.1 U1.58)
I2C_SDA: Interface (IC6.4 R114.1), MCU (IC3.5 R32.1 U1.59)
MCPWM: PoweSupply (IC1.3 R9.1), MCU (U1.23)
MCPWMCoil: PoweSupply (R7.1), MCU (U1.22)
MCPWMCoil2: PoweSupply (R1.2), MCU (U1.43)
Out1: MCU (U1.37), SwitchBlock (R67.1)
Out2: MCU (U1.39), SwitchBlock (R36.1)
Out3: MCU (U1.38), SwitchBlock (R83.1)
Out4: MCU (U1.40), SwitchBlock (R51.1)
Out5: MCU (U1.52), SwitchBlock (R52.1)
Out6: MCU (U1.51), SwitchBlock (R33.1)
Out7: MCU (U1.53), SwitchBlock (R68.1)
Out8: MCU (U1.62), SwitchBlock (R34.1)
Out9: MCU (U1.61), SwitchBlock (R84.1)
Out10: MCU (U1.2), SwitchBlock (R53.1)
Out11: MCU (U1.4), SwitchBlock (R86.1)
Out12: MCU (U1.3), SwitchBlock (R69.1)
Out13: MCU (U1.8), SwitchBlock (R35.1)
Out14: MCU (U1.10), SwitchBlock (R70.1)
Out15: MCU (U1.9), SwitchBlock (R54.1)
Out16: MCU (U1.11), SwitchBlock (R85.1)
PWMVoltMeas: MeasureBlock (DA2.6 DA2.7), MCU (U1.15)
RelOn1: MCU (U1.35), SwitchBlock (R102.1)
RelOn2: MCU (U1.36), SwitchBlock (R109.2)
RelOn3: MCU (U1.33), SwitchBlock (R103.1)
RelOn4: MCU (U1.34), SwitchBlock (R110.2)
RelOn5: MCU (U1.29), SwitchBlock (R104.1)
RelOn6: MCU (U1.30), SwitchBlock (R111.2)
RelOn7: MCU (U1.24), SwitchBlock (R105.1)
RelOn8: MCU (U1.25), SwitchBlock (R112.2)
RelOn9: MCU (U1.41), SwitchBlock (R101.1)
RelOn10: MCU (U1.42), SwitchBlock (R106.1)
RezSourse1: PoweSupply (5 pins), MeasureBlock (IC5.1 IC5.2 R11.1)
TempMeas: MeasureBlock (R3.2 XT2.1), MCU (U1.20)
VSupply1: MeasureBlock (C19.2 R41.1 R42.1 R48.2), SwitchBlock (32 pins)